# EasyEDA Pro project ProDocument_PWRTool 500_2024-05-11.epro

# Schematic PWRTool 500
Create Date: 2023-09-03; Page Name: P1; Project Name: PwrTool Project; Schematic Name: PWRTool 500; Update Date: 2024-04-07; Company: Voidbox Industries; Drawed: @clomads; Page Size: A4; Part Number: JLCPCB-002; Reviewed: EasyEDA Pro; Version: 22.03
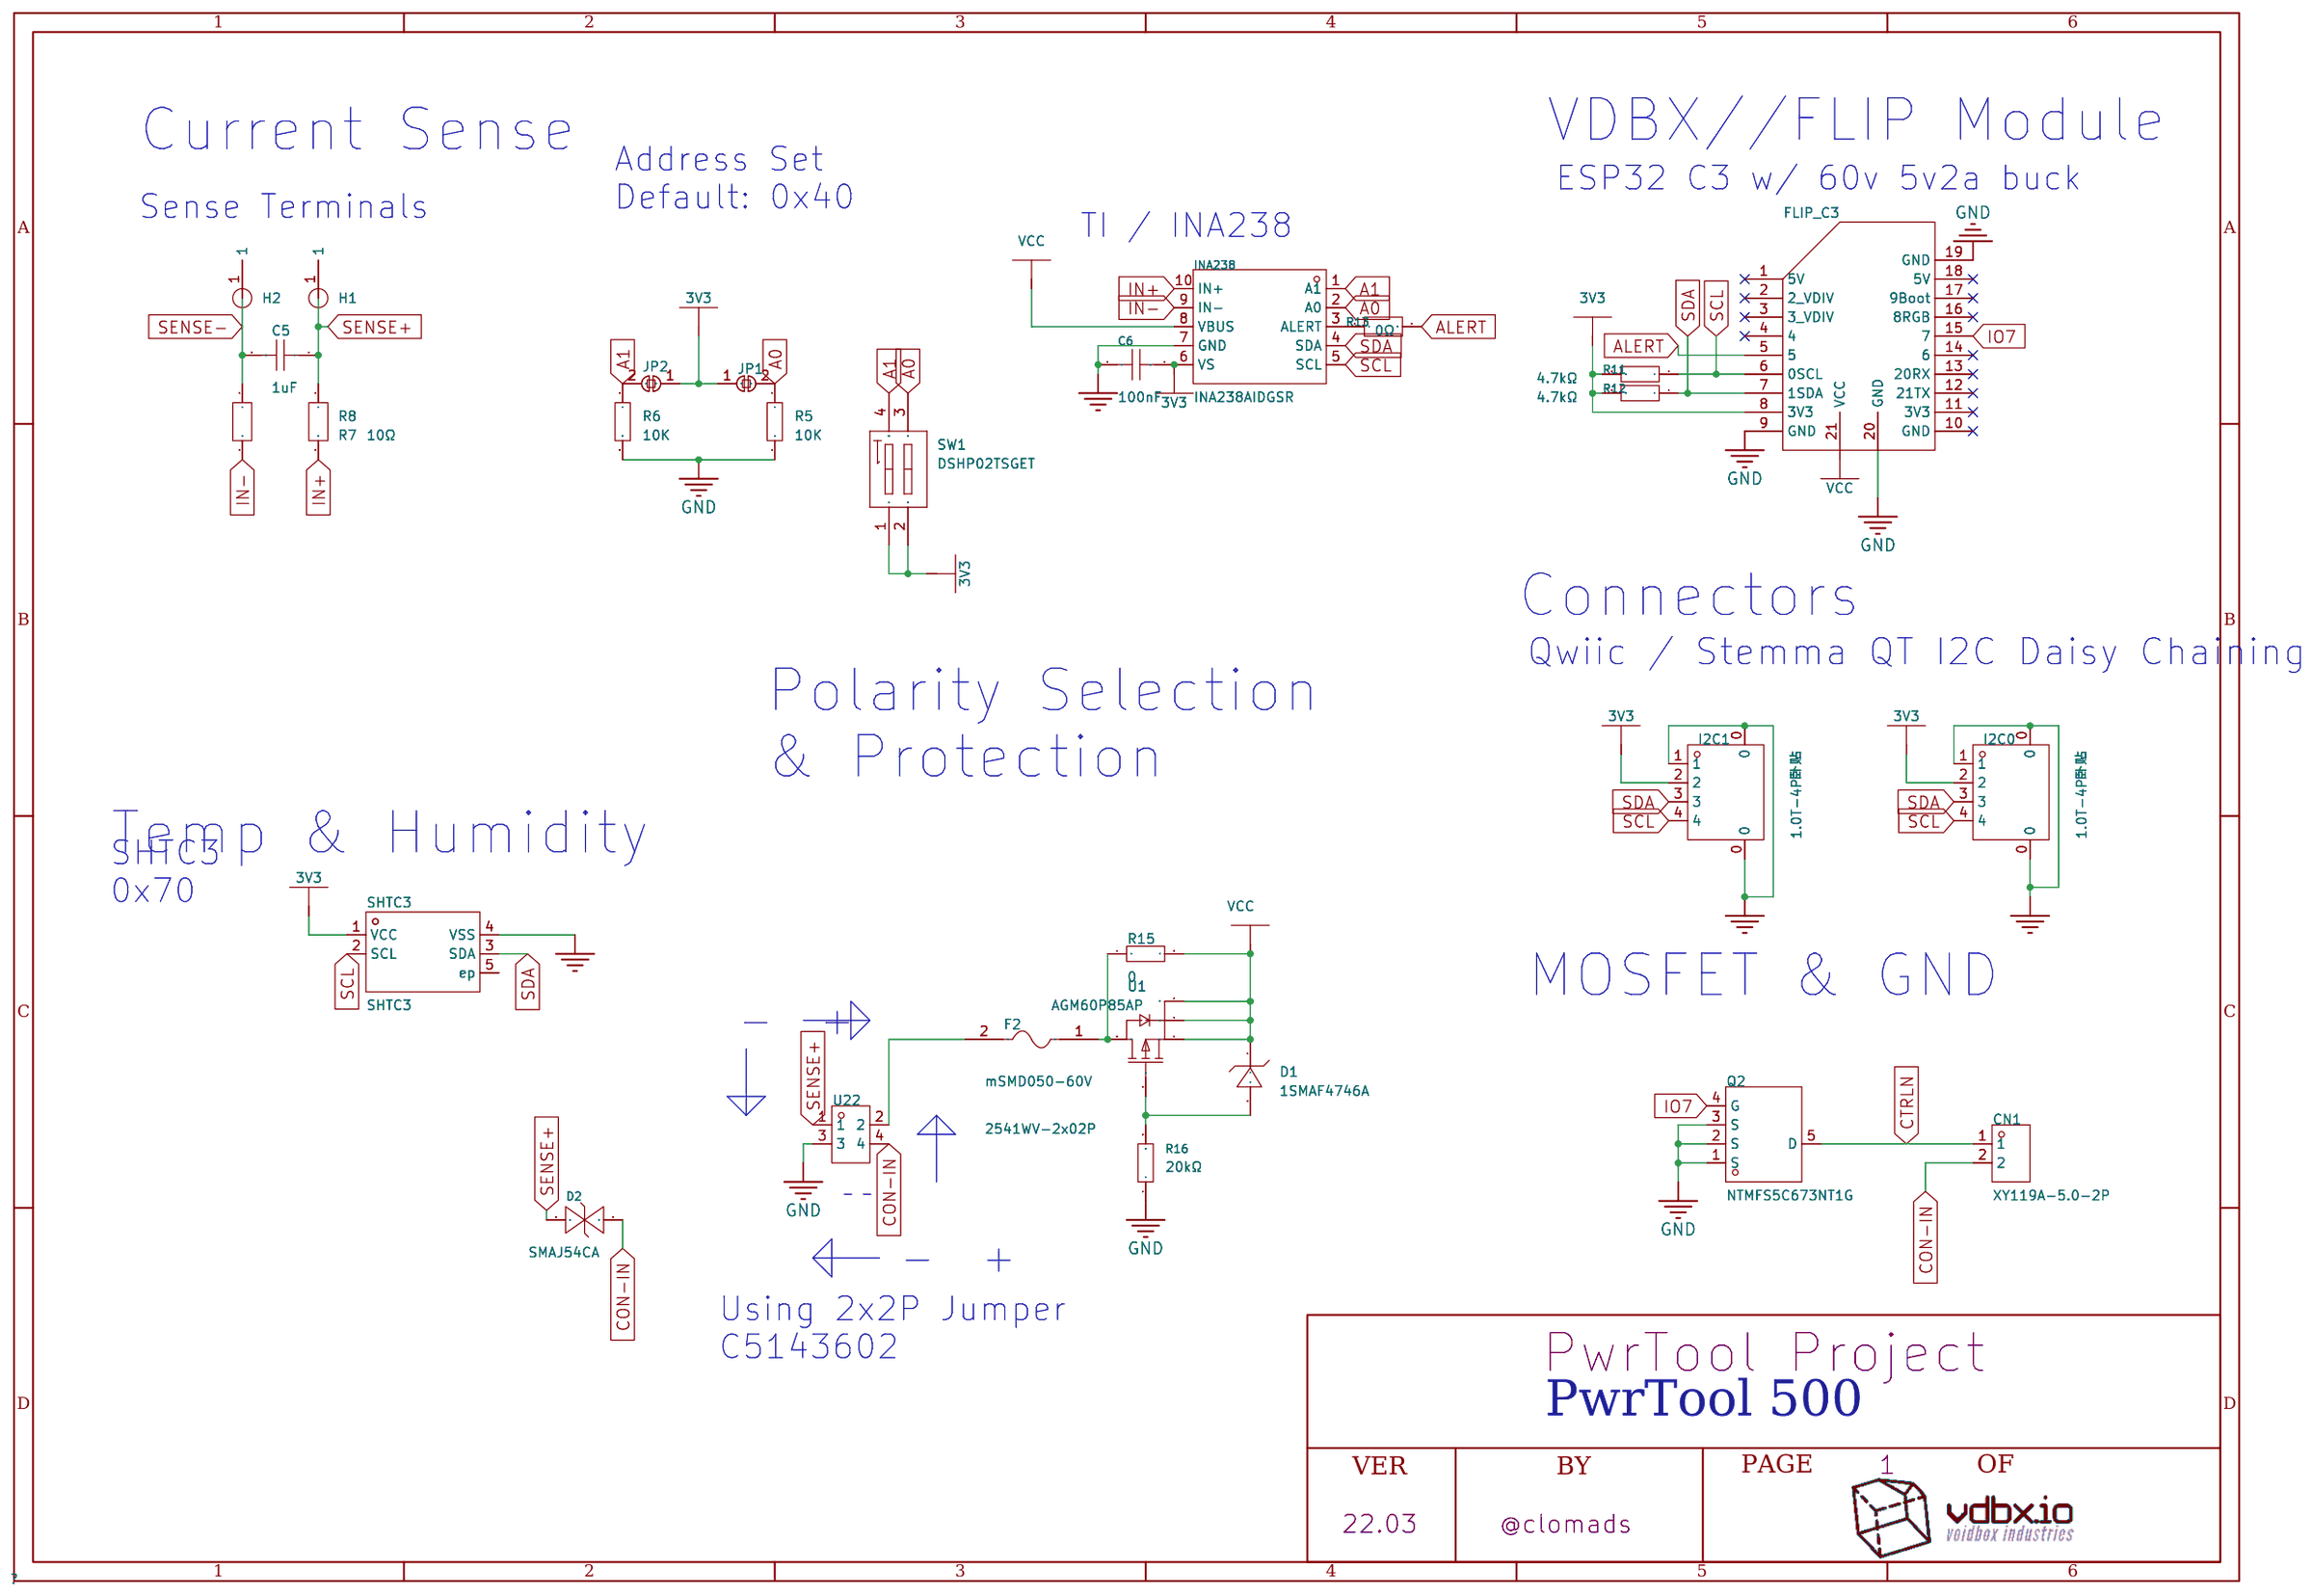
[diagram p0: schematic sheet]

## Parts
C5  1uF  [C1206]
C6  100nF  [C0402]
CN1  XY119A-5.0-2P  [CONN-TH_XY119A-5.0-2P]
D1  1SMAF4746A  [SMAF_L3.5-W2.6-LS4.7-RD]
D2  SMAJ54CA  [SMA_L4.4-W2.6-LS5.0-BI]
F2  mSMD050-60V  [F1812]
FLIP_C3  -  [VDBX//FLIP]
H1  M2.5x3  [HDMod_MountingHole:SMTSO2530CTJ]
H2  M2.5x3  [HDMod_MountingHole:SMTSO2530CTJ]
I2C0  1.0T-4P卧贴  [CONN-SMD_1.0T-4P]
I2C1  1.0T-4P卧贴  [CONN-SMD_1.0T-4P]
INA238  INA238AIDGSR  [VSSOP-10_L3.0-W3.0-P0.50-LS4.9-BL]
JP1  Jumper_SolderJumper_2_Bridged  [JUMPER]
JP2  Jumper_SolderJumper_2_Bridged  [JUMPER]
Q2  NTMFS5C673NT1G  [DFN-5_L4.9-W5.9-P1.27-LS6.2-BL]
R5  10K  [R0402]
R6  10K  [R0402]
R7  10Ω  [R0603]
R8  10Ω  [R0603]
R11  4.7kΩ  [R0805]
R12  4.7kΩ  [R0805]
R13  0Ω  [R0402]
R15  0  [R0603]
R16  20kΩ  [R0805]
SHTC3  SHTC3  [SENSORM-SMD_4P-L2.0-W2.0-P1.00]
SW1  DSHP02TSGET  [SW-SMD_4P_DSHP02TSGET]
U1  AGM60P85AP  [WDFN-5_L3.3-W3.3-P0.65-BL]
U22  2541WV-2x02P  [HDR-TH_4P-P2.54-V-M-R2-C2-S2.54]

## Library data of the parts
C5 = TCC1206X7R105K101HT: Capacitance:Tolerance:±10%Tolerance:±10%VoltageRated:TemperatureCoefficient:; LCSC Part Name: 1uF±10%100V; Supplier Part: C282823; Manufacturer: CCTC(三环); Supplier Footprint: 1206; JLCPCB Part Class: ExtendedPart; Datasheet: https://atta.szlcsc.com/upload/public/pdf/source/20221122/8593B2CC440C5C1368F9C0421AB13CFF.pdf; Supplier: LCSC; Tolerance: ±10%
C6 = CC0402JRX7R6BB104: Capacitance: Tolerance:±5% Tolerance:±5% Voltage Rated: Temperature Coefficient:; LCSC Part Name: 100nF ±5% 10V; Supplier Part: C527001; Manufacturer: YAGEO(国巨); Supplier Footprint: 0402; JLCPCB Part Class: Extended Part; Datasheet: https://atta.szlcsc.com/upload/public/pdf/source/20200508/C527001_BBD65F146D934E2FFF77EAA00FC82E63.pdf; Supplier: LCSC; Tolerance: ±5%
CN1 = XY119A-5.0-2P: Pitch:5mmNumberofPINsPerRow:2NumberofRows:1MountingStyle:ThroughHoleCurrentRating(Max):5AVoltageRating(Max):300VWireGauge-AWG:18~20WireGauge-mm?:1.5OperatingTemperatureRange:-OperatingTemperatureRange:-Color:Gray; LCSC Part Name: 5mm每排P数:2排数:1; Supplier Part: C784939; Manufacturer: XINLAIYA(新莱亚); Supplier Footprint: 直插,P=5mm; JLCPCB Part Class: ExtendedPart; Datasheet: https://atta.szlcsc.com/upload/public/pdf/source/20200917/C784939_AFEB00D015492A69142AB4BCD44AD19C.pdf; Supplier: LCSC; Pitch: 5mm; Number of PINs Per Row: 2; Number of Rows: 1; Mounting Style: ThroughHole; Current Rating (Max): 5A; Voltage Rating (Max): 300V; Wire Gauge - AWG: 18~20; Wire Gauge - mm?: 1.5; Color: Gray
D1 = 1SMAF4746A_C123896: Diode Configuration:Single Zener Voltage (Nom):18V Reverse Leakage Current (Ir):5uA@13V Zener Voltage (Range):16.8V~19.2V Zener Voltage (Range):16.8V~19.2V Power Dissipation:1W Zener Impedance (Zzt):20Ω Tolerance:±5% Tolerance:±5%; Supplier Part: C123896; Manufacturer: 晶导微电子; Supplier Footprint: SMAF; JLCPCB Part Class: Extended Part; Datasheet: https://atta.szlcsc.com/upload/public/pdf/source/20190103/C353591_7901ADC02E232AF6D8BA6DA3A998DE27.pdf; Supplier: LCSC; Diode Configuration: Single; Zener Voltage (Nom): 18V; Reverse Leakage Current (Ir): 5uA@13V; Zener Voltage (Range): 16.8V~19.2V; Power Dissipation: 1W; Zener Impedance (Zzt): 20Ω; Tolerance: ±5%
D2 = SMAJ54CA_C726801: LCSC Part Name: 双向TVS 54V截止 4.6A峰值脉冲; Supplier Part: C726801; Manufacturer: TWGMC(台湾迪嘉); Supplier Footprint: SMA(DO-214AC); JLCPCB Part Class: Extended Part; Datasheet: https://atta.szlcsc.com/upload/public/pdf/source/20200827/C726731_3930C18E0BE7F90724BF034A8102E5CA.pdf; Supplier: LCSC
F2 = mSMD050-60V: OperatingVoltage(Max):60VHoldCurrent:500mACurrentRating(Max):100ATripCurrent:1A; LCSC Part Name: 0.50A60V自恢复保险丝; Supplier Part: C70113; Manufacturer: 台湾陆海; Supplier Footprint: 1812; JLCPCB Part Class: ExtendedPart; Datasheet: https://atta.szlcsc.com/upload/public/pdf/source/20210511/C70113_9F360CEF46030BB0E1728371F919C576.pdf; Supplier: LCSC; Operating Voltage (Max): 60V; Hold Current: 500mA; Current Rating (Max): 100A; Trip Current: 1A
FLIP_C3 = VDBX//FLIP: 2.54mmDIPheaderforVDBX//FLIP
H1 H2 = Mechanical Mount Hole 3mm
I2C0 I2C1 = 1.0T-4P卧贴: ReferenceSeries:SHPitch:1mmPinsStructure:1x4PNumberofRows:1NumberofPINsPerRow:4RowSpacing:-MountingStyle:-ContactMaterial:Phosphorcoppe; LCSC Part Name: SH1mm1x4P卧贴; Supplier Part: C145956; Manufacturer: BOOMELE(博穆精密); Supplier Footprint: SMD,P=1mm; JLCPCB Part Class: ExtendedPart; Datasheet: https://atta.szlcsc.com/upload/public/pdf/source/20171115/C145956_15107293415261120441.pdf; Supplier: LCSC; Reference Series: SH; Pitch: 1mm; Pins Structure: 1x4P; Number of Rows: 1; Number of PINs Per Row: 4; Contact Material: Phosphorcoppe
INA238 = INA238AIDGSR: Supplier Part: C2868250; Manufacturer: TI(德州仪器); Supplier Footprint: VSSOP-10-0.5mm; JLCPCB Part Class: Extended Part; Datasheet: https://www.ti.com/cn/lit/gpn/ina238; Supplier: LCSC
JP1 JP2 = Jumper_SolderJumper_2_Bridged
Q2 = NTMFS5C673NT1G: Type:DrainSourceVoltage(Vdss):ContinuousDrainCurrent(Id):PowerDissipation(Pd):DrainSourceOnResistance(RDS(on)@Vgs,Id):8.9mΩ@10V,7AGateThresholdVoltage(Vgs(th)@Id):4V@35uATotalGateCharge(Qg@Vgs):9.6nC@10VInputCapacitance(Ciss@Vds; LCSC Part Name: SingleN?ChannelPowerMOSFET60V,50A,10.7mΩ; Supplier Part: C900313; Manufacturer: onsemi(安森美); Supplier Footprint: DFN-5(5.9x4.9); JLCPCB Part Class: ExtendedPart; Datasheet: https://atta.szlcsc.com/upload/public/pdf/source/20221020/06F350A49E6850FFF0301C489817AE16.pdf; Supplier: LCSC; Drain Source On Resistance (RDS(on)@Vgs,Id): 8.9mΩ@10V,7A; Gate Threshold Voltage (Vgs(th)@Id): 4V@35uA; Total Gate Charge (Qg@Vgs): 9.6nC@10V; Input Capacitance (Ciss@Vds): 680pF@30V; Reverse Transfer Capacitance (Crss@Vds): 6pF@30V; Operating Temperature: -55℃~+175℃@(Tj)
R5 R6 = Res_0402: Supplier Footprint: 0402
R7 R8 = CRCW060310R0FKEA: Type:ThickFilmResistorsResistance:Tolerance:±1%Tolerance:±1%Power(Watts):TemperatureCoefficient:±100ppm/℃TemperatureCoefficient:±100ppm/℃OverloadVoltage(Max):OperatingTemperatureRange:-55℃~+155℃OperatingTemperatureRange:-55℃~+155℃; LCSC Part Name: 10Ω±1%100mW; Supplier Part: C844919; Manufacturer: VISHAY(威世); Supplier Footprint: 0603; JLCPCB Part Class: ExtendedPart; Datasheet: https://atta.szlcsc.com/upload/public/pdf/source/20200927/C844919_23E7F5DF28E9421F105631C5C2D28736.pdf; Supplier: LCSC; Type: ThickFilmResistors; Tolerance: ±1%; Temperature Coefficient: ±100ppm/℃; Operating Temperature Range: -55℃~+155℃
R11 R12 = 0805W8J0472T5E: Type:Thick Film Resistors Resistance:4.7kΩ Tolerance:±5% Tolerance:±5% Power(Watts): Overload Voltage (Max): Temperature Coefficient:±100ppm/℃ Temperature Coefficient:±100ppm/℃ Operating Temperature Range:-55℃~+155℃ Operating Temperature Range:-55℃~+155℃; LCSC Part Name: 4.7kΩ ±5% 125mW 厚膜电阻; Supplier Part: C26022; Manufacturer: UNI-ROYAL(厚声); Supplier Footprint: 0805; JLCPCB Part Class: Extended Part; Datasheet: https://atta.szlcsc.com/upload/public/pdf/source/20200306/C422600_1E6D84923E4A46A82E41ADD87F860B5C.pdf; Supplier: LCSC; Type: Thick Film Resistors; Tolerance: ±5%; Temperature Coefficient: ±100ppm/℃; Operating Temperature Range: -55℃~+155℃
R13 = SCR0402J0R: Type:Thick Film Resistors Resistance:0Ω Tolerance:±5% Tolerance:±5% Power(Watts): Overload Voltage (Max): Operating Temperature Range:-55℃~+155℃ Operating Temperature Range:-55℃~+155℃; LCSC Part Name: 0Ω ±5%; Supplier Part: C3017451; Manufacturer: VO(翔胜); Supplier Footprint: 0402; JLCPCB Part Class: Extended Part; Datasheet: https://atta.szlcsc.com/upload/public/pdf/source/20220513/247AF9639BA21CF93567DC289CCC6A22.pdf; Supplier: LCSC; Type: Thick Film Resistors; Tolerance: ±5%; Operating Temperature Range: -55℃~+155℃
R15 = Res_0603: Supplier Footprint: 0603
R16 = 0805W8F2002T5E: Type:Thick Film Resistors Resistance:20kΩ Tolerance:±1% Tolerance:±1% Power(Watts): Overload Voltage (Max): Temperature Coefficient:±100ppm/℃ Temperature Coefficient:±100ppm/℃ Operating Temperature Range:-55℃~+155℃ Operating Temperature Range:-55℃~+155℃; LCSC Part Name: 20kΩ ±1% 125mW 厚膜电阻; Supplier Part: C4328; Manufacturer: UNI-ROYAL(厚声); Supplier Footprint: 0805; JLCPCB Part Class: Basic Part; Datasheet: https://atta.szlcsc.com/upload/public/pdf/source/20200306/C422600_1E6D84923E4A46A82E41ADD87F860B5C.pdf; Supplier: LCSC; Type: Thick Film Resistors; Tolerance: ±1%; Temperature Coefficient: ±100ppm/℃; Operating Temperature Range: -55℃~+155℃
SHTC3 = SHTC3: Supplier Part: C194656; Manufacturer: Sensirion(瑞士盛思锐); Supplier Footprint: DFN-4-EP(2x2); JLCPCB Part Class: ExtendedPart; Datasheet: https://atta.szlcsc.com/upload/public/pdf/source/20180702/C194656_6AF040A2C7857A0088E910E1F6414815.pdf; Supplier: LCSC
SW1 = DSHP02TSGET: Type:平拨，Notch式Circuit:SPSTNumberofPositions:2LeadPitch:1.27mmColor:Black; LCSC Part Name: 2位1.27间距; Supplier Part: C40735; Manufacturer: YE; Supplier Footprint: SMD-4P,4.1x5.4mm; JLCPCB Part Class: ExtendedPart; Datasheet: https://atta.szlcsc.com/upload/public/pdf/source/20150928/1457707425261.pdf; Supplier: LCSC; Type: 平拨，Notch式; Circuit: SPST; Number of Positions: 2; Lead Pitch: 1.27mm; Color: Black
U1 = AGM60P85AP: Type: Drain Source Voltage (Vdss): Continuous Drain Current (Id): Power Dissipation (Pd): Drain Source On Resistance (RDS(on)@Vgs,Id):80mΩ@10V,10A Gate Threshold Voltage (Vgs(th)@Id):1.6V@250uA Total Gate Charge (Qg@Vgs):23.7nC@10V Input Capacitance (Ciss; LCSC Part Name: P沟道 耐压:100V 电流:14A; Supplier Part: C17701049; Manufacturer: AGM-Semi(芯控源); Supplier Footprint: PDFN3.3x3.3; JLCPCB Part Class: Extended Part; Datasheet: https://atta.szlcsc.com/upload/public/pdf/source/20230912/81BEEC16733573234ABB3DA0E00F4E9C.pdf; Supplier: LCSC; Drain Source On Resistance (RDS(on)@Vgs,Id): 80mΩ@10V,10A; Gate Threshold Voltage (Vgs(th)@Id): 1.6V@250uA; Total Gate Charge (Qg@Vgs): 23.7nC@10V; Input Capacitance (Ciss@Vds): 1.45nF@25V; Operating Temperature: -55℃~+150℃@(Tj)
U22 = 2541WV-2x02P: Pin Structure:2x2P Pitch:2.54mm Mounting Type:Straight Number of Rows:双排 Number of Pins:4P Length of Mating Pin:6mm Insulation Height:2.54mm Length of End Connection Pin:3mm; Supplier Part: C5383103; Manufacturer: HanElectricity(瀚源); Supplier Footprint: 插件,P=2.54mm; Datasheet: https://atta.szlcsc.com/upload/public/pdf/source/20230330/E6AE37B56C45D0CDA24B058754300644.pdf; Supplier: LCSC; Pin Structure: 2x2P; Pitch: 2.54mm; Mounting Type: Straight; Number of Rows: 双排; Number of Pins: 4P; Length of Mating Pin: 6mm; Insulation Height: 2.54mm; Length of End Connection Pin: 3mm

## Nets
3V3: C6.2 FLIP_C3.8(3V3) I2C0.2 I2C1.2 INA238.6(VS) JP1.1(A) JP2.1(A) R11.2 R12.2 SHTC3.1(VCC) SW1.1(A1) SW1.2(A2)
GND: C6.1 FLIP_C3.9(GND) FLIP_C3.19(GND) FLIP_C3.20(GND) I2C0.0 I2C0.1 I2C1.0 I2C1.1 INA238.7(GND) Q2.1(S) Q2.2(S) Q2.3(S) R5.2 R6.2 R16.1 SHTC3.4(VSS) U22.3
VCC: D1.1(K) FLIP_C3.21(VCC) INA238.8(VBUS) R15.2 U1.1(S) U1.2(S) U1.3(S)
A0: INA238.2(A0) JP1.2(B) R5.1 SW1.3(B2)
A1: INA238.1(A1) JP2.2(B) R6.1 SW1.4(B1)
ALERT: FLIP_C3.5 R13.2
CON-IN: CN1.2 D2.1 U22.4
CTRLN: CN1.1 Q2.5(D)
IN+: INA238.10(IN+) R7.2
IN-: INA238.9(IN-) R8.2
IO7: FLIP_C3.15(7) Q2.4(G)
SCL: FLIP_C3.6(0SCL) I2C0.4 I2C1.4 INA238.5(SCL) R11.1 SHTC3.2(SCL)
SDA: FLIP_C3.7(1SDA) I2C0.3 I2C1.3 INA238.4(SDA) R12.1 SHTC3.3(SDA)
SENSE+: C5.1 D2.2 H1.1 R7.1 U22.1
SENSE-: C5.2 H2.1 R8.1
$1N138373: INA238.3(ALERT) R13.1
$1N140761: D1.2(A) R16.2 U1.4(G)
$1N140943: F2.1 R15.1 U1.5(D)
$1N142006: F2.2 U22.2

Not connected (* = marked no-connect by the designer): FLIP_C3 1(5V)* 2(2 VDIV)* 3(3 VDIV)* 4* 10(GND)* 11(3V3)* 12(21TX)* 13(20RX)* 14(6)* 16(8RGB)* 17(9Boot)* 18(5V)*; SHTC3 5(ep)

## Notes on the sheet
- Current Sense
- VDBX//FLIP Module
- ESP32 C3 w/ 60v 5v2a buck
- Sense Terminals
- Address Set
  Default: 0x40
- TI / INA238
- Connectors
- Qwiic / Stemma QT I2C Daisy Chaining
- Polarity Selection
  & Protection
- Temp & Humidity
- SHTC3
  0x70
- MOSFET & GND
- -  +
- - -
- -  +
- Using 2x2P Jumper
- C5143602
- PwrTool 500

# Board PWRTool 500
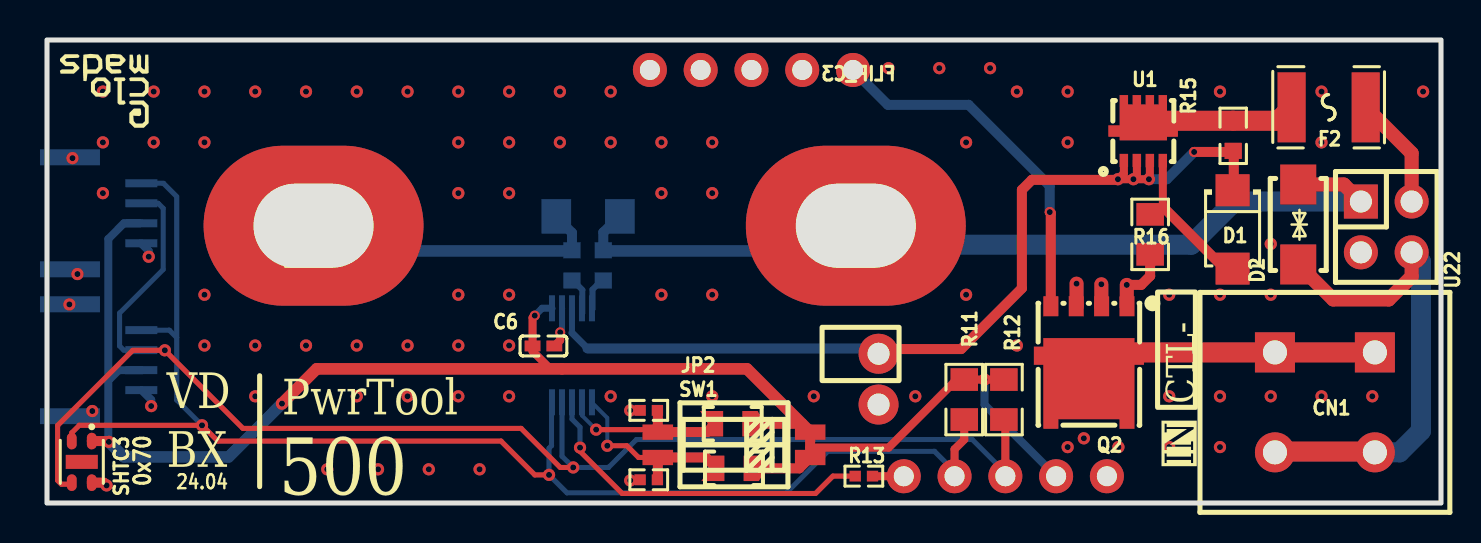
[diagram p1: board, top side]
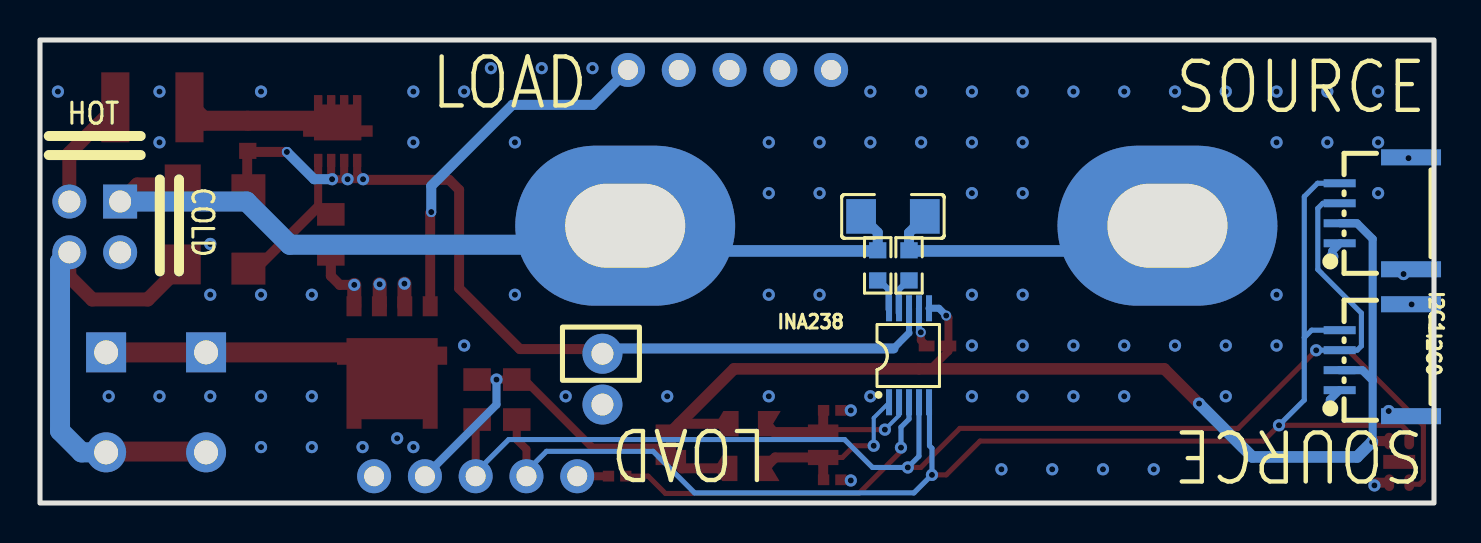
[diagram p2: board, bottom side, seen from below]

Outline 69.73 x 23.16 mm; copper layers: Top Layer, Inner1, Inner2, Bottom Layer. Coordinates in mm from the lower left corner of the outline.
Outline path: rectangle 0,23.16 69.73,0
Stack: Top Layer 0.035mm 外层铜厚1oz / Dielectric1 0.2104mm 7628 RC49% 8.6mil / Inner1 0.0152mm 内层铜厚 / Dielectric2 1.065mm 1.1mm H/HOZ 含铜 / Inner2 0.0152mm 内层铜厚 / Dielectric3 0.2104mm 7628 RC49% 8.6mil / Bottom Layer 0.035mm 外层铜厚1oz

## Design rules (mm)
spacing safeClearance (default): track to track 0.152, other pairs 0.152 to 0.3
track width trackWidth (default): min 0.127, default 0.254, max 2.54
differential pair differentialPair (default): width min 0.127, default 0.254, max 2.54; gap min 0.152, default 0.152
via viaSize (default): diameter min 0.5, default 0.61, max 10; hole min 0.3, default 0.305, max 6

## Placement (name value [footprint] x y rotation side)
C5  1uF  [C1206]  27.07 14.33 180 bottom
C6  100nF  [C0402]  24.84 7.85 180 top
CN1  XY119A-5.0-2P  [CONN-TH_XY119A-5.0-2P]  63.93 5.03 270 top
D1  1SMAF4746A  [SMAF_L3.5-W2.6-LS4.7-RD]  59.31 13.68 270 top
D2  SMAJ54CA  [SMA_L4.4-W2.6-LS5.0-BI]  62.59 13.93 90 top
F2  mSMD050-60V  [F1812]  64.11 19.79 0 top
FLIP_C3  -  [vdbx//flip]  33.97 15.31 270 bottom
H1  M2.5x3  [hdmod_mountinghole:smtso2530ctj]  40.46 13.87 270 top
H2  M2.5x3  [hdmod_mountinghole:smtso2530ctj]  13.33 13.87 90 top
I2C0  1.0T-4P卧贴  [CONN-SMD_1.0T-4P]  2.93 14.49 90 bottom
I2C1  1.0T-4P卧贴  [CONN-SMD_1.0T-4P]  2.93 7.14 90 bottom
INA238  INA238AIDGSR  [VSSOP-10_L3.0-W3.0-P0.50-LS4.9-BL]  26.26 7.39 180 bottom
JP1  Jumper_SolderJumper_2_Bridged  [JUMPER]  33.03 3.97 180 top
JP2  Jumper_SolderJumper_2_Bridged  [JUMPER]  33.09 1.73 180 top
Q2  NTMFS5C673NT1G  [DFN-5_L4.9-W5.9-P1.27-LS6.2-BL]  52.12 8.03 180 top
R5  10K  [R0402]  30.1 4.63 180 top
R6  10K  [R0402]  30.1 1.16 180 top
R7  10Ω  [R0603]  27.83 11.88 270 bottom
R8  10Ω  [R0603]  26.26 11.88 270 bottom
R11  4.7kΩ  [R0805]  45.88 5.17 90 top
R12  4.7kΩ  [R0805]  47.87 5.17 90 top
R13  0Ω  [R0402]  40.86 1.34 0 top
R15  0  [R0603]  59.34 18.36 270 top
R16  20kΩ  [R0805]  55.18 13.43 90 top
SHTC3  SHTC3  [SENSORM-SMD_4P-L2.0-W2.0-P1.00]  1.74 2.06 180 top
SW1  DSHP02TSGET  [SW-SMD_4P_DSHP02TSGET]  34.37 2.91 90 top
U1  AGM60P85AP  [WDFN-5_L3.3-W3.3-P0.65-BL]  54.84 17.87 0 top
U22  2541WV-2x02P  [HDR-TH_4P-P2.54-V-M-R2-C2-S2.54]  67 13.81 270 top

## Footprints (pads in the part's own frame, mm; a bottom-side part is the same pattern mirrored in y, then rotated)
C0402
  rect 0.79x0.54 smd: 1(-0.545,0) 2(0.545,0)
C1206
  rect 1.485x1.728 smd: 1(-1.593,0) 2(1.593,0)
CONN-SMD_1.0T-4P
  rect 0.8x3 smd: 0(-2.8,-1.784) 0(2.8,-1.784)
  rect 0.4x1.6 smd: 1(-1.498,1.784) 2(-0.498,1.784) 3(0.502,1.784) 4(1.502,1.784)
CONN-TH_XY119A-5.0-2P
  rect 2x2 hole 1.2: 1(-2.5,2.5) 1(-2.5,-2.5)
  round 2 hole 1.2: 2(2.5,2.5) 2(2.5,-2.5)
DFN-5_L4.9-W5.9-P1.27-LS6.2-BL
  rect 0.75x1 smd: 1(-1.905,-1.811) 2(-0.635,-1.811) 3(0.635,-1.811) 4(1.905,-1.811)
  custom 5.51x4.53 smd: 5(0,1.811)
F1812
  rect 1.407x3.499 smd: 1(-1.853,0) 2(1.853,0)
hdmod_mountinghole:smtso2530ctj
  oval 8x11 hole 4.2x6: 1(0,0)
HDR-TH_4P-P2.54-V-M-R2-C2-S2.54
  rect 1.7x1.7 hole 1.1: 1(-1.27,-1.27)
  round 1.7 hole 1.1: 2(-1.27,1.27) 3(1.27,-1.27) 4(1.27,1.27)
JUMPER
  custom 1.143x1.27 smd: 1(-2.134,0) 2(-0.406,0)
R0402
  rect 0.566x0.54 smd: 1(-0.433,0) 2(0.433,0)
R0603
  rect 0.806x0.864 smd: 1(-0.753,0) 2(0.753,0)
R0805
  rect 1.133x1.377 smd: 1(-1,0) 2(1,0)
SENSORM-SMD_4P-L2.0-W2.0-P1.00
  oval 0.49x0.83 smd: 1(-0.5,-1.04) 2(0.5,-1.04) 3(0.5,1.04) 4(-0.5,1.04)
  rect 1.6x0.7 smd: 5(0,0)
SMA_L4.4-W2.6-LS5.0-BI
  rect 2x1.8 smd: 1(-2,0) 2(2,0)
SMAF_L3.5-W2.6-LS4.7-RD
  rect 1.6x1.7 smd: 1(-1.96,0) 2(1.96,0)
SW-SMD_4P_DSHP02TSGET
  rect 0.762x1.524 smd: 1(-0.635,-3.81) 2(0.635,-3.81) 3(0.635,3.81) 4(-0.635,3.81)
vdbx//flip
  round 1.7 hole 1: 5(13.97,-8.89) 6(13.97,-11.43) 7(13.97,-13.97) 8(13.97,-16.51) 9(13.97,-19.05) 15(-6.35,-6.35) 16(-6.35,-3.81) 17(-6.35,-1.27) 18(-6.35,1.27) 19(-6.35,3.81)
  round 2 hole 1.1: 20(10.384,-7.628) 21(7.844,-7.628)
VSSOP-10_L3.0-W3.0-P0.50-LS4.9-BL
  rect 0.3x1.3 smd: 1(-1,-2.35) 2(-0.5,-2.35) 3(0,-2.35) 4(0.5,-2.35) 5(1,-2.35) 6(1,2.35) 7(0.5,2.35) 8(0,2.35) 9(-0.5,2.35) 10(-1,2.35)
WDFN-5_L3.3-W3.3-P0.65-BL
  rect 0.42x0.66 smd: 1(-0.975,-0.735) 2(-0.325,-0.735) 3(0.325,-0.735) 4(0.975,-0.735)
  custom 3.48x2.265 smd: 5(0,0.735)

## Nets
As in the schematic.

Pads without a net: FLIP_C3 16 17 18; SHTC3 5

## Via types
v1: diameter 0.61, hole 0.305, Top Layer to Bottom Layer, 19 vias
v2: diameter 0.5, hole 0.305, Top Layer to Bottom Layer, 4 vias
v3: diameter 0.61, hole 0.304, Top Layer to Bottom Layer, 83 vias

## Routing (per net, layer and track width the routed paths; a pad name or vN(x,y) marks a point on that pad's centre or on a via; arc(x,y) is an arc through that point)
3V3: length 82.8
  Top Layer w0.4: R12.2 v1(46.9,6.17) R11.2 45.5,6.17 42.1,2.77 38.18,2.77 ; v2(24.4,9.37) 24.29,9.26 24.29,7.59 25.18,6.71 25.77,6.71 ; FLIP_C3.8 50.48,1.56
  Top Layer w0.5: JP2.1 37.63,1.73 SW1.1 SW1.2 ; SHTC3.1 3.06,3.1 v1(3.1,3.06) ; JP1.1 37.76,3.97
  Top Layer w0.58: v1(11.75,4.97) 13.49,6.71 35.02,6.71 SW1.2
  Bottom Layer w0.35: v2(24.4,9.37) 24.77,9.74 INA238.6
  Bottom Layer w0.4: v1(3.1,3.06) 3.07,3.09 3.07,6.13 ; 3.07,6.13 3.58,6.64 4.73,6.64 ; 3.07,6.13 3.07,13.2 3.85,13.99 4.7,13.99 ; FLIP_C3.8 46.9,4.92 v1(46.9,6.17)
  Bottom Layer w0.58: v1(3.1,3.06) 3.85,2.31 9.09,2.31 v1(11.75,4.97)
GND: length 10
  Top Layer w0.4: v2(25.67,8.54) 25.67,8.15 C6.1
  Top Layer w0.5: 55.18,11.99 55.18,11.36 54.74,10.91 v3(54.01,10.91) ; SHTC3.4 2.84,1.02 v1(2.98,0.88)
  Top Layer w0.7: v3(52.74,10.94) 52.74,9.85 Q2.2 ; v3(51.5,10.97) 51.5,9.86 Q2.3 ; v3(54.01,10.91) 54.01,9.85 Q2.1
  Bottom Layer w0.3: INA238.7 25.77,9.74 25.77,8.63 v2(25.67,8.54)
  Bottom Layer w0.4: 4.7,12.99 5.09,12.61 v1(5.09,12.32) ; 4.73,5.64 5.21,5.16 v1(5.21,4.85)
  vias: v1(2.27,4.6) v1(29.18,4.63) v1(29.18,1.13) v3(1.12,9.93) v3(1.28,17.25) v3(1.52,11.45) v3(2.8,20.58) v3(2.8,18.04) v3(2.8,15.5) v3(5.34,20.58) v3(5.34,18.04) v3(7.88,20.58) v3(7.88,18.04) v3(7.88,10.42) v3(7.88,7.88) v3(10.42,20.58) v3(10.42,7.88) v3(10.42,5.34) v3(12.96,20.58) v3(12.96,7.88) v3(14.02,1.69) v3(15.5,20.58) v3(15.5,7.88) v3(15.5,5.34) v3(16.56,1.69) v3(18.04,20.58) v3(18.04,7.88) v3(18.04,5.34) v3(19.1,1.69) v3(20.58,20.58) v3(20.58,18.04) v3(20.58,15.5) v3(20.58,10.42) v3(20.58,7.88) v3(20.58,5.34) v3(21.64,1.69) v3(23.12,20.58) v3(23.12,18.04) v3(23.12,15.5) v3(23.12,10.42) v3(23.12,7.88) v3(23.12,5.34) v3(25.66,20.58) v3(25.66,18.04) v3(28.2,20.58) v3(28.2,18.04) v3(28.2,5.34) v3(30.74,18.04) v3(30.74,15.5) v3(30.74,10.42) v3(33.28,18.04) v3(33.28,15.5) v3(33.28,10.42) v3(33.28,5.34) v3(38.36,5.34) v3(42.1,21.75) v3(43.44,5.34) v3(44.64,21.75) v3(45.98,18.04) v3(45.98,10.42) v3(47.18,21.75) v3(48.52,20.58) v3(48.52,7.88) v3(51.06,20.58) v3(51.06,18.04) v3(51.06,2.8) v3(51.87,3.24) v3(53.6,2.8) v3(56.14,10.42) v3(56.14,5.34) v3(56.14,2.8) v3(58.68,20.58) v3(58.68,10.42) v3(58.68,5.34) v3(58.68,2.8) v3(61.22,12.96) v3(61.22,10.42) v3(61.22,5.34) v3(63.76,20.58) v3(63.76,18.04) v3(63.76,5.34) v3(66.3,5.34) v3(68.84,20.58)
VCC: length 47
  Top Layer w0.4: 54.52,17.13 54.52,16.36 v1(54.35,16.19) ; v1(54.35,16.19) v1(53.57,16.19) 53.87,16.49 U1.1 ; v1(54.35,16.19) v1(55.12,16.19) 55.17,16.24 U1.3 ; 59.37,17.56 59.46,17.56
  Top Layer w0.5: 59.37,17.56 59.37,15.67 59.43,15.67 ; 59.37,17.56 59.37,17.61 ; 59.37,17.56 v2(57.38,17.56) ; v1(53.57,16.19) 53.54,16.16 49.27,16.16 48.77,15.66 48.77,10.74 45.73,7.7 41.83,7.7 FLIP_C3.21
  Bottom Layer w0.254: 41.33,7.73 FLIP_C3.21
  Bottom Layer w0.3: 26.26,8.51 INA238.8
  Bottom Layer w0.35: 27.04,7.73 26.26,8.51
  Bottom Layer w0.5: v2(57.38,17.56) 56.02,16.19 v1(55.12,16.19) ; 27.04,7.73 41.33,7.73
A0: length 9
  Top Layer w0.254: SW1.3 30.43,3.67 v1(27.47,3.67)
  Top Layer w0.5: R5.1 30.56,4.61 SW1.3 33.02,3.55 JP1.2
  Bottom Layer w0.2: INA238.2 26.76,4.38 v1(27.47,3.67)
A1: length 9.6
  Top Layer w0.254: SW1.4 29.59,2.28 29.01,2.86 v1(28.03,2.86)
  Top Layer w0.5: R6.1 30.56,1.18 SW1.4 32.96,2.28 JP2.2
  Bottom Layer w0.2: v1(28.03,2.86) 28.03,4.26 27.25,5.03 INA238.1
ALERT: length 1.5
  Top Layer w0.4: 41.33,1.34 FLIP_C3.5
CON-IN: length 25
  Top Layer w0.7: U22.4 68.27,11.33 67.12,10.18 64.34,10.18 D2.1
  Top Layer w1: CN1.2 66.39,2.57 61.45,2.57 61.43,2.55 CN1.2
  Bottom Layer w1: U22.4 68.73,12.07 68.73,3.61 67.66,2.53 CN1.2
CTRLN: length 14.9
  Top Layer w1: CN1.1 CN1.1 53.44,7.53 Q2.5
IN+: length 1.4
  Bottom Layer w0.3: 27.29,9.69 27.29,10.67 27.55,10.94 27.57,10.94 27.58,10.95
IN-: length 2.1
  Bottom Layer w0.3: 26.78,9.5 26.78,10.66 26.34,11.1 26.01,11.1
IO7: length 18.3
  Top Layer w0.5: Q2.4 50.22,14.5 v2(50.16,14.55)
  Bottom Layer w0.5: v2(50.16,14.55) 50.16,15.85 46.1,19.91 42.06,19.91 40.32,21.66
SCL: length 70.1
  Top Layer w0.254: SHTC3.2 1.24,3.51 1.62,3.89 v1(7.75,3.89) 8.54,3.1 22.71,3.1 24.4,1.41 v1(25.11,1.41)
  Top Layer w0.4: R11.1 45.88,3.17 45.4,2.69 FLIP_C3.6
  Bottom Layer w0.254: 6.49,8.27 6.12,8.64 4.73,8.64 ; 6.49,8.27 6.49,5.15 v1(7.75,3.89) ; 6.49,8.27 6.49,15.33 5.82,15.99 4.7,15.99 ; 25.24,4.72 25.24,2.86 25.11,2.74 v1(25.11,1.41) 26.01,0.51 36.99,0.51 39.06,2.58 44.4,2.58 45.62,1.36
SDA: length 74.1
  Top Layer w0.254: v1(26.32,1.78) 25.67,1.78 23.72,3.73 9.8,3.73 v1(5.89,7.64) 4.29,7.64 0.53,3.88 0.53,1.13 0.72,0.94 1.16,0.94 SHTC3.3
  Top Layer w0.4: 47.94,4.16 FLIP_C3.7
  Bottom Layer w0.254: 4.7,14.99 5.56,14.99 5.81,14.74 5.81,11.68 3.63,9.5 3.63,7.85 3.84,7.64 5.89,7.64 v1(5.89,7.64) ; 48.11,1.36 46.29,3.17 29.49,3.17 28.09,1.78 v1(26.32,1.78) 25.77,2.34 25.77,5.04
SENSE+: length 44.7
  Top Layer w0.7: U22.1 64.87,15.93 D2.2
  Bottom Layer w0.5: 27.9,12.64 27.93,12.61 ; R7.1 27.83,13.53 28.63,14.33
  Bottom Layer w0.58: 40.52,12.63 40.5,12.61 27.93,12.61
  Bottom Layer w1: U22.1 59.4,15.08 57.24,12.92 41.46,12.92 40.46,11.92
SENSE-: length 14.6
  Bottom Layer w0.5: R8.1 26.26,13.52 25.44,14.33
  Bottom Layer w0.58: 13.53,12.61 26.13,12.61
$1N138373: length 17.6
  Top Layer w0.254: R13.1 39.31,1.34 38.44,0.48 28.77,0.48 26.66,2.58 v1(26.66,2.77)
  Bottom Layer w0.254: v1(26.66,2.77) 26.66,3.79 26.26,4.2 INA238.3
$1N140761: length 7.3
  Top Layer w0.4: U1.4 55.82,14.82
  Top Layer w0.5: 55.82,14.82 59.34,11.29
$1N140943: length 7.9
  Top Layer w0.5: U1.5 55.44,19.2
  Top Layer w1: 55.44,19.12 R15.1 61.59,19.12 F2.1
$1N142006: length 5.7
  Top Layer w0.7: F2.2 68.27,17.49 U22.2

## Copper pours and planes (outline as drawn; the poured copper is in the pictures)
GND on Inner1: 0,-1.1 69.92,-1.1 69.92,25.43 0,25.43
GND on Inner2: -1.73,27.11 70.16,27.11 70.16,-1.89 -1.73,-1.89

## Text on the board
Bottom Silkscreen Layer: HOT | COLD | SOURCE | LOAD
Top Silkscreen Layer: 24.04 | 0x70 | 00-0x40 | IN | CTL- | VD / BX | PwrTool | 500
